# Altium schematic sheet [04] - INPUTS.SchDoc: INPUTS
size A3; Author: Gabriel Piñango; DocumentNumber: 4; Revision: V1I1; SheetNumber: 4; SheetTotal: 6; Collaborator: Gabriel Pinango; Project: MultiTestcard; VersionRevision: V1I1; Designer: Gabriel Pinango
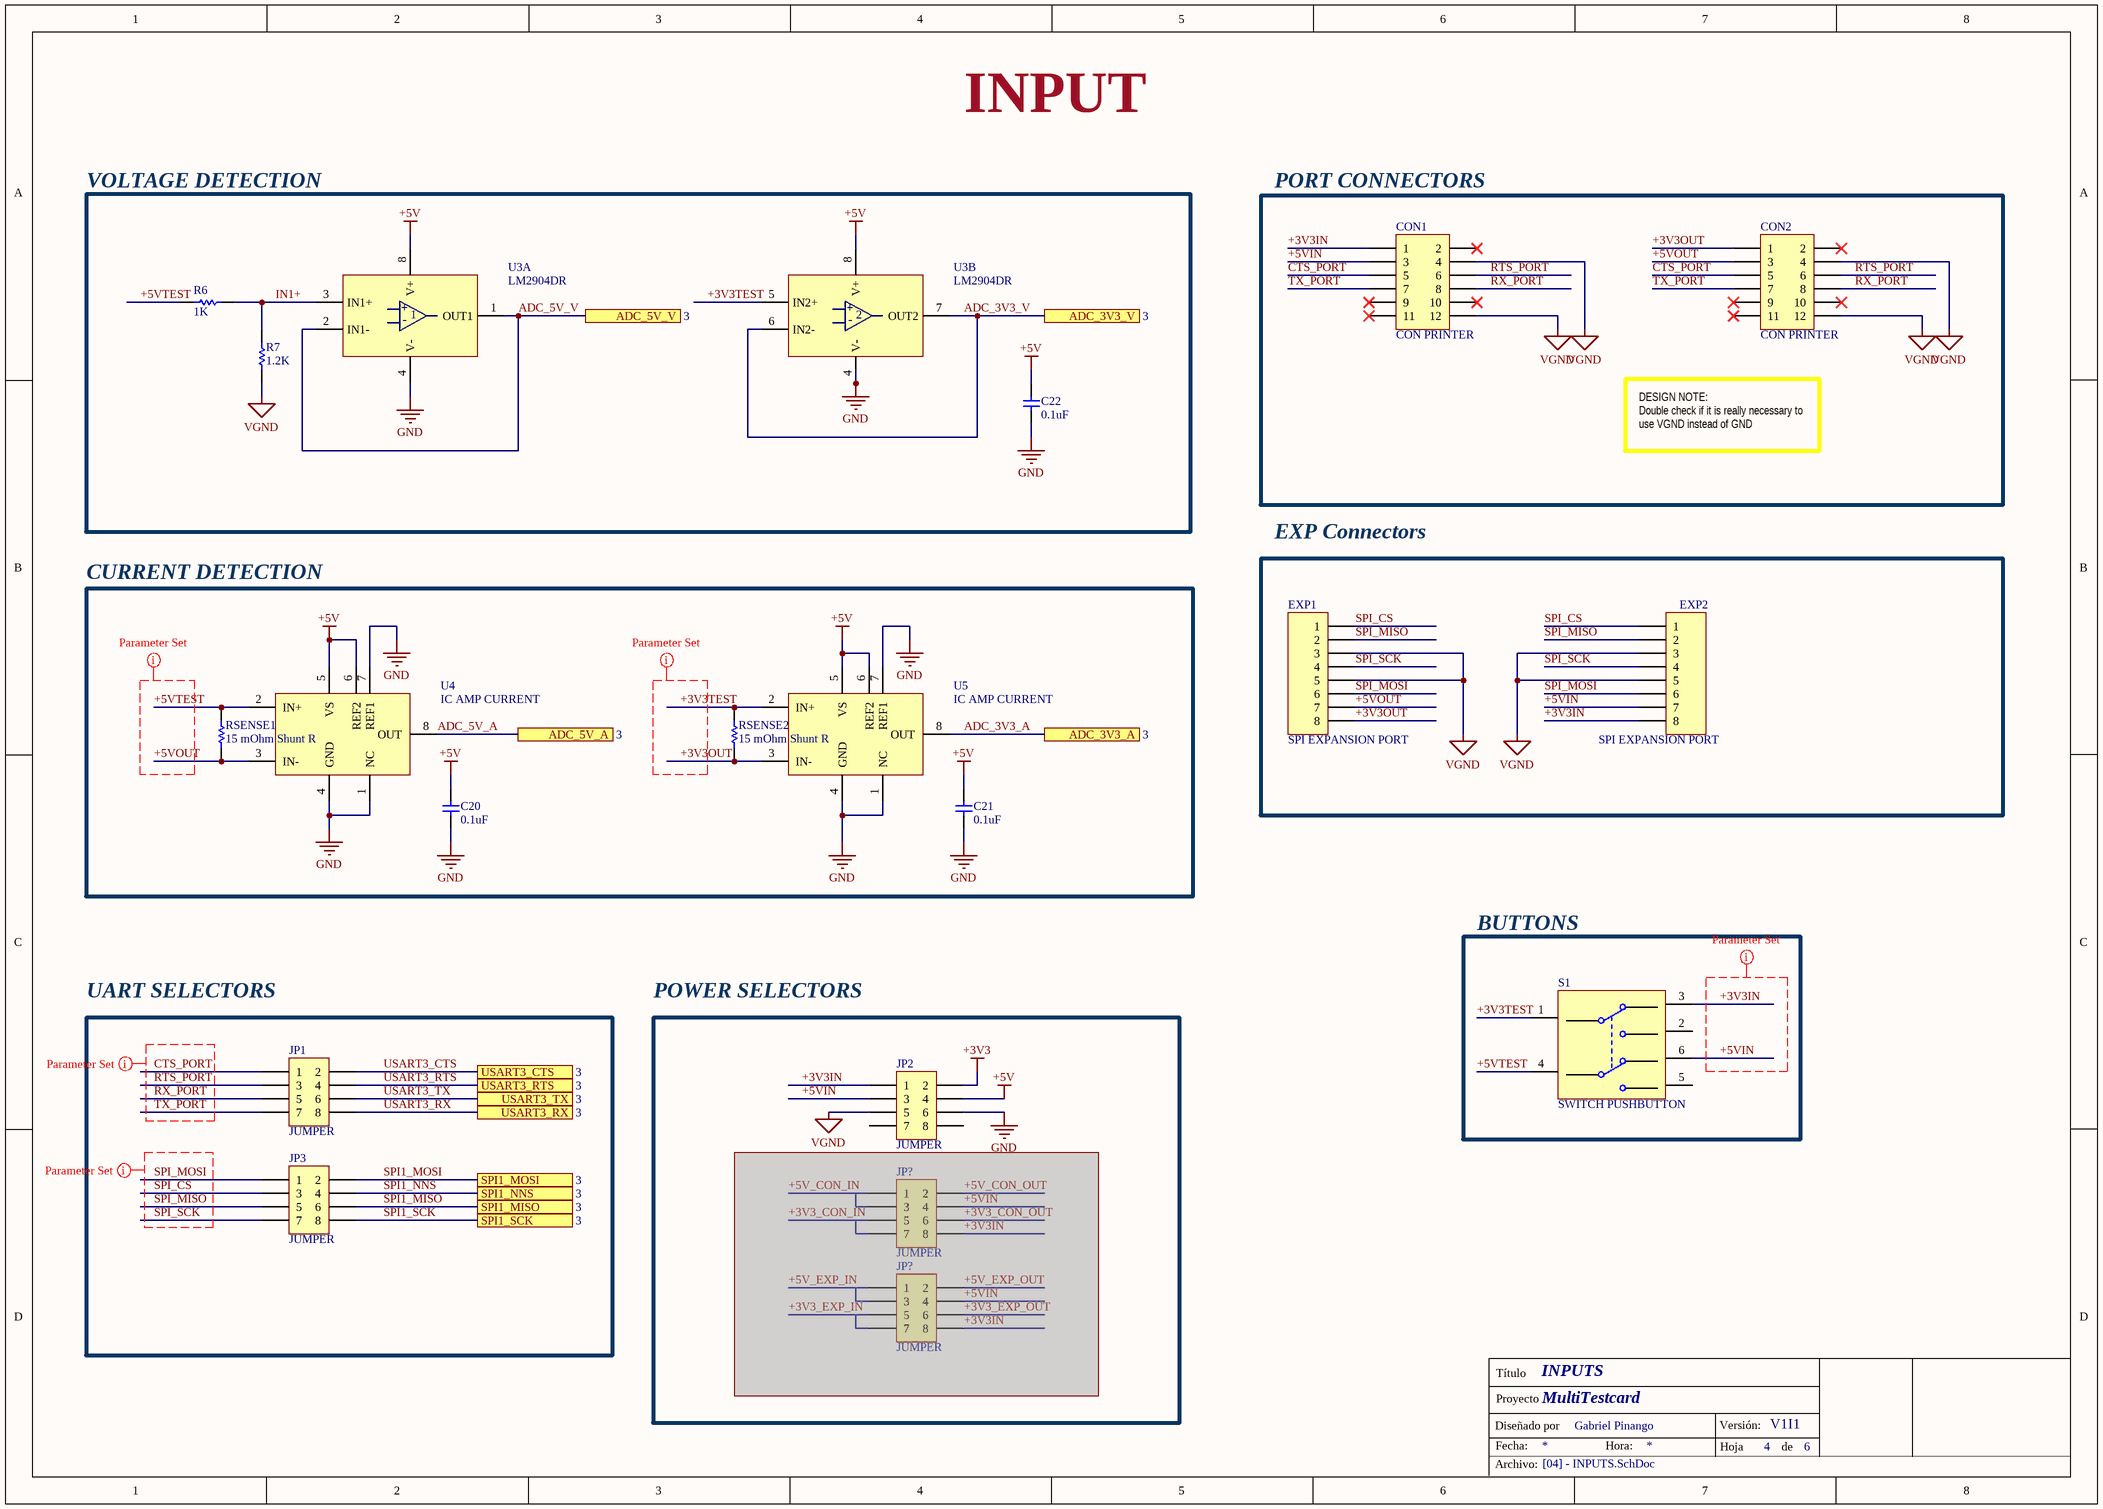
[diagram p0: [04] - INPUTS.SchDoc]

## Parts
(Parts that share a designator on the sheet are numbered #1, #2 ... from top to bottom, then left to right.)
C20  0.1uF  [CC-0603]
C21  0.1uF  [CC-0603]
C22  0.1uF  [CC-0603]
CON1  CON PRINTER  [Header 2x6 B12B PHDS]
CON2  CON PRINTER  [Header 2x6 B12B PHDS]
EXP1  SPI EXPANSION PORT  [CONN FPC/FFC 8POS]
EXP2  SPI EXPANSION PORT  [CONN FPC/FFC 8POS]
JP1  JUMPER  [HDR4X2]
JP2  JUMPER  [HDR4X2]
JP3  JUMPER  [HDR4X2]
JP?#1  JUMPER  [HDR4X2]  (masked out: inside a compile mask, not in the netlist)
JP?#2  JUMPER  [HDR4X2]  (masked out: inside a compile mask, not in the netlist)
R6  1K  [R-0603]
R7  1.2K  [R-0603]
RSENSE1  15 mOhm Shunt R  [R-2512]
RSENSE2  15 mOhm Shunt R  [R-2512]
S1  SWITCH PUSHBUTTON  [UB26SKW03N]
U3  LM2904DR  [8-SOIC]  (parts A,B of 2)
U4  IC AMP CURRENT  [8-TSSOP]
U5  IC AMP CURRENT  [8-TSSOP]

## Blocks framed on the sheet
VOLTAGE DETECTION: C22 R6 R7 U3
PORT CONNECTORS: CON1 CON2
EXP Connectors: EXP1 EXP2
CURRENT DETECTION: C20 C21 RSENSE1 RSENSE2 U4 U5
BUTTONS: S1
UART SELECTORS: JP1 JP3
POWER SELECTORS: JP2 JP?#1 JP?#2

## Ports
ADC_3V3_A (see 3), ADC_3V3_V (see 3), ADC_5V_A (see 3), ADC_5V_V (see 3), SPI1_MISO (see 3), SPI1_MOSI (see 3), SPI1_NNS (see 3), SPI1_SCK (see 3), USART3_CTS (see 3), USART3_RTS (see 3), USART3_RX (see 3), USART3_TX (see 3)

## Nets
+3V3: JP2.2
+5V: C20.1 C21.1 C22.1 JP2.4 U3.8(V+) U4.5(VS) U4.6(REF2) U5.5(VS) U5.6(REF2)
GND: C20.2 C21.2 C22.2 JP2.6 U3.4(V-) U4.1(NC) U4.4(GND) U4.7(REF1) U5.1(NC) U5.4(GND) U5.7(REF1)
VGND: CON1.4 CON1.12 CON2.4 CON2.12 EXP1.3 EXP1.5 EXP2.3 EXP2.5 JP2.5 R7.1
+3V3IN: CON1.1 EXP2.8 JP2.1 S1.3(NC1)
+3V3OUT: CON2.1 EXP1.8 RSENSE2.1 U5.3(IN-)
+3V3TEST: RSENSE2.2 S1.1(COMMON1) U3.5(IN2+) U5.2(IN+)
+5VIN: CON1.3 EXP2.7 JP2.3 S1.6(NC2)
+5VOUT: CON2.3 EXP1.7 RSENSE1.1 U4.3(IN-)
+5VTEST: R6.1 RSENSE1.2 S1.4(COMMON2) U4.2(IN+)
ADC_3V3_A: U5.8(OUT) ; port ADC_3V3_A
ADC_3V3_V: U3.6(IN2-) U3.7(OUT2) ; port ADC_3V3_V
ADC_5V_A: U4.8(OUT) ; port ADC_5V_A
ADC_5V_V: U3.1(OUT1) U3.2(IN1-) ; port ADC_5V_V
CTS_PORT: CON1.5 CON2.5 JP1.1
IN1+: R6.2 R7.2 U3.3(IN1+)
RTS_PORT: CON1.6 CON2.6 JP1.3
RX_PORT: CON1.8 CON2.8 JP1.5
SPI1_MISO: JP3.6 ; port SPI1_MISO
SPI1_MOSI: JP3.2 ; port SPI1_MOSI
SPI1_NNS: JP3.4 ; port SPI1_NNS
SPI1_SCK: JP3.8 ; port SPI1_SCK
SPI_CS: EXP1.1 EXP2.1 JP3.3
SPI_MISO: EXP1.2 EXP2.2 JP3.5
SPI_MOSI: EXP1.6 EXP2.6 JP3.1
SPI_SCK: EXP1.4 EXP2.4 JP3.7
TX_PORT: CON1.7 CON2.7 JP1.7
USART3_CTS: JP1.2 ; port USART3_CTS
USART3_RTS: JP1.4 ; port USART3_RTS
USART3_RX: JP1.8 ; port USART3_RX
USART3_TX: JP1.6 ; port USART3_TX

Not connected (* = marked no-connect by the designer): CON1 2* 9* 10* 11*; CON2 2* 9* 10* 11*; JP2 7 8; S1 2(NO1) 5(NO2)

## Layout directives
net class PWR_TEST: +3V3IN, +3V3OUT, +3V3TEST, +5VIN, +5VOUT, +5VTEST
net class SPI_TEST: SPI_CS, SPI_MISO, SPI_MOSI, SPI_SCK
net class UART_TEST: CTS_PORT, RTS_PORT, RX_PORT, TX_PORT

## Notes on the sheet
- INPUT
- DESIGN NOTE:
  Double check if it is really necessary to use VGND instead of GND
- Título
- Diseñado por
- Fecha:
- Proyecto
- Hora:
- Versión:
- Hoja
- de
- Archivo:
- (in symbol LM2904DR, part A) +; -
- (in symbol LM2904DR, part B) +; -

## Library data of the parts
C20-C22 = CGA3E2X7R1H104K080AA: CAP CER 0.1uF 50V X7R 0603; Manufacturer: TDK; Capacitance: 100nF; Tolerance: 10%; Supplier 1: Digi-Key; Manufacturer Part Number: CGA3E2X7R1H104K080AA; Stock 1: 11580568; Pricing 1: 1=0.1, 10=0.075, 100=0.0335, 500=0.0239, 1000=0.0188 (USD); Mount: Surface Mount; Case/Package: 0603; Weight: 7.1E-05oz; Case Code (Imperial): 0603; Case Code (Metric): 1608; Min Operating Temperature: -55°C; Max Operating Temperature: 125°C; Packaging: Tape and Reel; Package Quantity: 1; Voltage Rating: 50V; Dielectric: X7R; Voltage Rating (DC): 50V; Termination: SMD/SMT; Voltage: 50V; Composition: Ceramic; Length: 1.6mm; Height: 0.8mm; Width: 0.8mm; Thickness: 0.035inch; Depth: 0.8mm; Ratings: AEC-Q200; Radiation Hardening: No; REACH SVHC: No SVHC; Lead Free: Lead Free; ComponentLink1URL: http://www.farnell.com/datasheets/1796654.pdf?src-supplier=Mouser; ComponentLink1Description: http://www.farnell.com/datasheets/1796654.pdf?src-supplier=Mouser; ComponentLink2URL: http://product.tdk.com/capacitor/mlcc/en/documents/mlccspec_automotive_general_midvoltage_en.pdf?src-supplier=Future+Electronics; ComponentLink2Description: http://product.tdk.com/capacitor/mlcc/en/documents/mlccspec_automotive_general_midvoltage_en.pdf?src-supplier=Future+Electronics; ComponentLink3URL: http://www.farnell.com/datasheets/1735392.pdf?src-supplier=Element14; ComponentLink3Description: http://www.farnell.com/datasheets/1735392.pdf?src-supplier=Element14; ComponentLink4URL: https://www.verical.com/server-webapp/html/getDatasheet?partID=715867&src-supplier=Verical; ComponentLink4Description: https://www.verical.com/server-webapp/html/getDatasheet?partID=715867&src-supplier=Verical; ComponentLink5URL: http://www.farnell.com/datasheets/1796654.pdf?src-supplier=Newark; ComponentLink5Description: http://www.farnell.com/datasheets/1796654.pdf?src-supplier=Newark; Supplier Part Number 1: 445-5666-6-ND
CON1 CON2 = DF11-12DP-2DSA(24): CONN HEADER VERT 12POS 2MM; Manufacturer: Hirose; Number of Positions: 12; Gender: Male; Connector Type: Male Pin; Current Rating: 2A; Voltage Rating: 250V; Insulation Resistance: 1GR; Row Spacing: 0.079inch; Supplier 1: Digi-Key; Manufacturer Part Number: DF11-12DP-2DSA(24); Stock 1: 1827; Pricing 1: 1=0.61, 10=0.57, 100=0.437, 500=0.38, 1000=0.3135 (USD); Mount: Through Hole; Color: Black; Housing Color: Black; Housing Material: Polyamide; Contact Plating: Tin,Gold; Contact Material: Brass,Copper Alloy,Tin; Number of Rows: 2; Package Quantity: 34; Packaging: Rail/Tube; Termination: Solder; Number of Contacts: 12; Contact Gender: Male; Orientation: Straight; Fastening Type: Detent; Pitch: 2mm; Contact Mating Length: 0.118inch; Radiation Hardening: No; Lead Free: Lead Free; REACH SVHC: No SVHC; Flammability Rating: UL94 V-0; ComponentLink1URL: http://uk.rs-online.com/webdocs/14ef/0900766b814efacf.pdf?src-supplier=RSComponents; ComponentLink1Description: http://uk.rs-online.com/webdocs/14ef/0900766b814efacf.pdf?src-supplier=RSComponents; ComponentLink2URL: https://www.distrelec.biz/Web/Downloads/_t/ds/DF11serie_eng_tds.pdf?mime=application%2Fpdf&src-supplier=Distrelec; ComponentLink2Description: https://www.distrelec.biz/Web/Downloads/_t/ds/DF11serie_eng_tds.pdf?mime=application%2Fpdf&src-supplier=Distrelec; Supplier Part Number 1: H10233-ND
EXP1 EXP2 = HLW8S-2C7LF: CONN FFC FPC VERT 8POS 1MM PCB; Manufacturer: Amphenol FCI; Contact Resistance: 30mR; Current Rating: 1A; Voltage Rating: 100V; Number of Positions: 8; Contact Location: Top; Insulation Resistance: 500MR; Gender: Receptacle; Wire/Cable Type: Straight; Supplier 1: Digi-Key; Manufacturer Part Number: HLW8S-2C7LF; Stock 1: 4257; Pricing 1: 1=0.22, 10=0.204, 25=0.1744, 50=0.1526, 100=0.1417, 250=0.1254, 500=0.1199, 1000=0.0981, 2500=0.0899 (USD); Mount: Through Hole; Contact Material: Bronze; Contact Plating: Tin; Housing Color: Black; Housing Material: Polybutylene; Min Operating Temperature: -55°C; Max Operating Temperature: 85°C; Number of Rows: 1; Package Quantity: 250; Packaging: Tray; Voltage Rating (AC): 100V; Termination: Solder; Max Voltage Rating (AC): 100V; Number of Contacts: 8; Max Voltage Rating (DC): 100V; Orientation: Straight; Length: 10.6mm; Pitch: 1mm; Depth: 3.9mm; Width: 3.9mm; Radiation Hardening: No; REACH SVHC: No SVHC; Lead Free: Lead Free; Flammability Rating: UL94 V-0; ComponentLink1URL: https://cdn.amphenol-icc.com/media/wysiwyg/files/drawing/hlw01lf.pdf?src-supplier=Digi-Key; ComponentLink1Description: https://cdn.amphenol-icc.com/media/wysiwyg/files/drawing/hlw01lf.pdf?src-supplier=Digi-Key; ComponentLink2URL: http://portal.fciconnect.com/Comergent/fci/drawing/hlw01lf.pdf?src-supplier=Avnet; ComponentLink2Description: http://portal.fciconnect.com/Comergent/fci/drawing/hlw01lf.pdf?src-supplier=Avnet; Supplier Part Number 1: 609-1821-ND
JP1-JP3 JP?#1 JP?#2 = 77313-801-08LF: Headers & Wire Housings 8P STR DR TMT HDR .38 AU .425IN LENGTH; Manufacturer: Amphenol FCI; Number of Contacts: 8; Current Rating: 3A; Voltage Rating: 1.5kV; Insulation Resistance: 5GR; Gender: Male; Connector Type: Male Pin; Pitch: 2.54mm; Row Spacing: 0.1inch; Contact Post Length: 2.41mm; Supplier 1: Digi-Key; Manufacturer Part Number: 77313-801-08LF; Stock 1: 0; Mount: Through Hole; Contact Plating: Gold,GXT; Color: Black; Contact Material: Bronze; Housing Color: Black; Housing Material: Thermoplastic; Min Operating Temperature: -65°C; Max Operating Temperature: 125°C; Number of Rows: 2; Termination: Solder; Package Quantity: 500; Packaging: Bulk; Contact Gender: Male; Number of Positions: 8; Max Voltage Rating (AC): 1.5kV; Orientation: Straight; Series: BERGSTIK®, MezzSelect™, Basics+; Contact Type: Male Pin; Length: 10.16mm; Contact Mating Length: 0.23inch; Depth: 4.83mm; Radiation Hardening: No; Lead Free: Lead Free; Flammability Rating: UL94 V-0; ComponentLink1URL: http://portal.fciconnect.com/Comergent//fci/drawing/77313.pdf?src-supplier=Digi-Key; ComponentLink1Description: http://portal.fciconnect.com/Comergent//fci/drawing/77313.pdf?src-supplier=Digi-Key; ComponentLink2URL: http://portal.fciconnect.com/Comergent/fci/drawing/77313.pdf?src-supplier=Avnet; ComponentLink2Description: http://portal.fciconnect.com/Comergent/fci/drawing/77313.pdf?src-supplier=Avnet; Supplier Part Number 1: 77313-801-08LF-ND
R6 = RC0603FR-071KL: RES SMD 1K OHM 1% 1/10W 0603; Manufacturer: Yageo; Resistance: 1kR; Power Rating: 100mW; Temperature Coefficient: 100ppm/°C; Voltage Rating: 50V; Supplier 1: Digi-Key; Manufacturer Part Number: RC0603FR-071KL; Stock 1: 48702346; Pricing 1: 1=0.1, 10=0.024, 100=0.0097, 1000=0.0044, 2500=0.0038 (USD); Case/Package: 0603; Case Code (Imperial): 0603; Case Code (Metric): 1608; Contact Plating: Tin,Matte; Min Operating Temperature: -55°C; Max Operating Temperature: 155°C; Tolerance: 1%; Packaging: Tape and Reel; Military Standard: Not; Termination: SMD/SMT; Composition: Thick Film; Length: 1.6mm; Height: 0.45mm; Depth: 0.8mm; Radiation Hardening: No; REACH SVHC: No SVHC; Lead Free: Lead Free; ComponentLink1URL: http://documents.rs-components.com/techlib://itc_doclist_GB.htm?stockno=5048928&src-supplier=RSComponents; ComponentLink1Description: http://documents.rs-components.com/techlib://itc_doclist_GB.htm?stockno=5048928&src-supplier=RSComponents; ComponentLink2URL: http://www.yageo.com/documents/recent/PYu-RC0603_51_RoHS_L_4.pdf?src-supplier=Avnet+Europe; ComponentLink2Description: http://www.yageo.com/documents/recent/PYu-RC0603_51_RoHS_L_4.pdf?src-supplier=Avnet+Europe; ComponentLink3URL: http://www.farnell.com/datasheets/2167052.pdf?src-supplier=Element14; ComponentLink3Description: http://www.farnell.com/datasheets/2167052.pdf?src-supplier=Element14; ComponentLink4URL: http://www.farnell.com/datasheets/1868787.pdf?src-supplier=Element14; ComponentLink4Description: http://www.farnell.com/datasheets/1868787.pdf?src-supplier=Element14; ComponentLink5URL: http://www.yageo.com/documents/recent/PYu-RC_Group_51_RoHS_L_2.pdf?src-supplier=Avnet; ComponentLink5Description: http://www.yageo.com/documents/recent/PYu-RC_Group_51_RoHS_L_2.pdf?src-supplier=Avnet; ComponentLink6URL: https://www.verical.com/server-webapp/html/getDatasheet?partID=404327&src-supplier=Verical; ComponentLink6Description: https://www.verical.com/server-webapp/html/getDatasheet?partID=404327&src-supplier=Verical; ComponentLink7URL: http://www.farnell.com/datasheets/443971.pdf?src-supplier=Element14; ComponentLink7Description: http://www.farnell.com/datasheets/443971.pdf?src-supplier=Element14; Supplier Part Number 1: 311-1.00KHRDKR-ND
R7 = CRCW06031K20FKEA: RES SMD 1.2K OHM 1% 1/10W 0603; Manufacturer: Vishay; Resistance: 1.2kR; Power Rating: 100mW; Voltage Rating: 75V; Temperature Coefficient: 100ppm/°C; Supplier 1: Digi-Key; Manufacturer Part Number: CRCW06031K20FKEA; Stock 1: 93302; Pricing 1: 1=0.1, 10=0.036, 100=0.0146, 1000=0.0065, 2500=0.0057 (USD); Mount: Surface Mount; Case/Package: 0603; Weight: 7.1E-05oz; Case Code (Metric): 1608; Case Code (Imperial): 0603; Contact Plating: Tin; Min Operating Temperature: -55°C; Max Operating Temperature: 155°C; Tolerance: 1%; Packaging: Tape and Reel; Composition: Thick Film; Military Standard: Not; Termination: SMD/SMT; Voltage Rating (DC): 75V; Package Quantity: 10; Number of Terminations: 2; Max Power Dissipation: 100mW; Features: Automotive AEC-Q200; Length: 1.55mm; Height: 0.45mm; Width: 0.033inch; Depth: 0.85mm; Radiation Hardening: No; REACH SVHC: Unknown; Lead Free: Lead Free; ComponentLink1URL: http://www.vishay.com/docs/20035/dcrcwe3.pdf?src-supplier=Digi-Key; ComponentLink1Description: http://www.vishay.com/docs/20035/dcrcwe3.pdf?src-supplier=Digi-Key; ComponentLink2URL: http://uk.rs-online.com/webdocs/0d98/0900766b80d98afc.pdf?src-supplier=RSComponents; ComponentLink2Description: http://uk.rs-online.com/webdocs/0d98/0900766b80d98afc.pdf?src-supplier=RSComponents; ComponentLink3URL: https://www.alliedelec.com/m/d/0c934d6939ccefa68dbe0b96d821c8cf.pdf?src-supplier=Allied+Electronics; ComponentLink3Description: https://www.alliedelec.com/m/d/0c934d6939ccefa68dbe0b96d821c8cf.pdf?src-supplier=Allied+Electronics; ComponentLink4URL: http://www.alliedelec.com/m/d/0c934d6939ccefa68dbe0b96d821c8cf.pdf?src-supplier=Allied+Electronics; ComponentLink4Description: http://www.alliedelec.com/m/d/0c934d6939ccefa68dbe0b96d821c8cf.pdf?src-supplier=Allied+Electronics; ComponentLink5URL: https://www.distrelec.biz/Web/Downloads/a_/en/flD-CRCW-e3_data_en.pdf?mime=application%2Fpdf&src-supplier=Distrelec; ComponentLink5Description: https://www.distrelec.biz/Web/Downloads/a_/en/flD-CRCW-e3_data_en.pdf?mime=application%2Fpdf&src-supplier=Distrelec; ComponentLink6URL: http://www.farnell.com/datasheets/2045673.pdf?src-supplier=Element14; ComponentLink6Description: http://www.farnell.com/datasheets/2045673.pdf?src-supplier=Element14; ComponentLink7URL: http://www.mouser.com/ds/2/427/dcrcwe3-109170.pdf?src-supplier=Mouser; ComponentLink7Description: http://www.mouser.com/ds/2/427/dcrcwe3-109170.pdf?src-supplier=Mouser; ComponentLink8URL: http://www.farnell.com/datasheets/2111203.pdf?src-supplier=Element14; ComponentLink8Description: http://www.farnell.com/datasheets/2111203.pdf?src-supplier=Element14; Supplier Part Number 1: 541-1.20KHCT-ND
RSENSE1 RSENSE2 = CRA2512-FZ-R015ELF: Res 2512 0.015 Ohm 1% 3W 75ppm/C Molded SMD SMD T/R; Manufacturer: Bourns; Resistance: 15mR; Temperature Coefficient: 75ppm/°C; Supplier 1: Digi-Key; Manufacturer Part Number: CRA2512-FZ-R015ELF; Stock 1: 25516; Pricing 1: 1=0.69, 10=0.578, 25=0.4956, 50=0.446, 100=0.3881, 250=0.3468, 500=0.2808, 1000=0.2271 (USD); Mount: Surface Mount; Case/Package: 2512; Case Code (Metric): 6432; Case Code (Imperial): 2512; Min Operating Temperature: -55°C; Max Operating Temperature: 170°C; Power Rating: 3W; Tolerance: 1%; Packaging: Tape and Reel; Package Quantity: 1; Composition: Metal Film,Thick Film; Number of Terminations: 2; Military Standard: Not; Termination: Solder; Max Power Dissipation: 3W; Features: Moisture Resistant; Length: 0.254inch; Height: 0.035inch; Width: 0.126inch; Depth: 3.2mm; REACH SVHC: No SVHC; Lead Free: Lead Free; ComponentLink1URL: http://www.bourns.com/docs/Product-Datasheets/CRA.pdf?src-supplier=Digi-Key; ComponentLink1Description: http://www.bourns.com/docs/Product-Datasheets/CRA.pdf?src-supplier=Digi-Key; ComponentLink2URL: https://www.bourns.com/docs/Product-Datasheets/CRA.pdf?src-supplier=Digi-Key; ComponentLink2Description: https://www.bourns.com/docs/Product-Datasheets/CRA.pdf?src-supplier=Digi-Key; ComponentLink3URL: http://uk.rs-online.com/webdocs/0ddc/0900766b80ddce06.pdf?src-supplier=RSComponents; ComponentLink3Description: http://uk.rs-online.com/webdocs/0ddc/0900766b80ddce06.pdf?src-supplier=RSComponents; ComponentLink4URL: http://www.produktinfo.conrad.com/datenblaetter/1000000-1099999/001055548-da-01-en-WID_CRA2512_FZ_R015ELF__0_015_OHM_3W_1_.pdf?src-supplier=Conrad; ComponentLink4Description: http://www.produktinfo.conrad.com/datenblaetter/1000000-1099999/001055548-da-01-en-WID_CRA2512_FZ_R015ELF__0_015_OHM_3W_1_.pdf?src-supplier=Conrad; Supplier Part Number 1: CRA2512-FZ-R015ELFDKR-ND
S1 = UB25SKW03N-G: SWITCH PUSHBUTTON DPDT 5A 125V; Manufacturer: NKK Switches; Mechanical Life: 1000000Cycles; Voltage Rating (DC): 30V; Electrical Life: 10000Cycles; Switch Function: On-Mom; Actuator Type: Square, Button; Supplier 1: Digi-Key; Manufacturer Part Number: UB25SKW03N-G; Stock 1: 41; Pricing 1: 1=7.79, 10=7.22, 25=7.03, 50=6.84, 100=6.46, 250=6.27, 500=5.89, 1000=5.32 (USD); Mount: Through Hole; Contact Plating: Silver; Min Operating Temperature: -20°C; Max Operating Temperature: 70°C; Packaging: Bulk; Current Rating: 5A; Package Quantity: 1; Voltage Rating (AC): 125V; Termination: PC Pin; Throw Configuration: DPDT; Orientation: Vertical; Lead Free: Lead Free; Flammability Rating: UL94 V-0; ComponentLink1URL: http://www.nkkswitches.com/pdf/ubnonilluminated.pdf?src-supplier=Digi-Key; ComponentLink1Description: http://www.nkkswitches.com/pdf/ubnonilluminated.pdf?src-supplier=Digi-Key; ComponentLink2URL: http://www.nkkswitches.com/pdf/ubilluminated.pdf?src-supplier=Future+Electronics; ComponentLink2Description: http://www.nkkswitches.com/pdf/ubilluminated.pdf?src-supplier=Future+Electronics; Supplier Part Number 1: 360-3471-ND
U3 = LM2904DR: Operational Amplifier, Dual, 700 kHz, 2, 0.3 V/ s, 1.5V to 13V, SOIC, 8 ;RoHS Compliant: Yes; Manufacturer: Texas Instruments; Unity Gain Bandwidth Product: 700kHz; Slew Rate: 0.3V/µs; Common Mode Rejection Ratio: 50dB; Max Supply Voltage: 26V; Min Supply Voltage: 3V; Voltage Gain: 100dB; Number of Channels: 2; Output Current: 30mA; Nominal Supply Current: 1.2mA; Dual Supply Voltage: 9V; Input Bias Current: 250nA; Input Offset Voltage (Vos): 7mV; Operating Supply Current: 1mA; Supplier 1: Digi-Key; Manufacturer Part Number: LM2904DR; Stock 1: 117399; Pricing 1: 1=0.41, 10=0.305, 25=0.2752, 100=0.15, 250=0.145, 500=0.13, 1000=0.1 (USD); Mount: Surface Mount; Case/Package: SOIC; Number of Pins: 8; Min Operating Temperature: -40°C; Max Operating Temperature: 125°C; Min Dual Supply Voltage: 1.5V; Max Dual Supply Voltage: 13V; Packaging: Tape and Reel; Bandwidth: 700kHz; Package Quantity: 1; Operating Supply Voltage: 13V; Number of Circuits: 2; Gain Bandwidth Product: 700kHz; Output Current per Channel: 30mA; Number of Elements: 2; Number of Amplifiers: 2; Length: 4.9mm; Height: 1.58mm; Width: 3.91mm; Radiation Hardening: No; REACH SVHC: No SVHC; Lead Free: Lead Free; ComponentLink1URL: http://www.jameco.com/Jameco/Products/ProdDS/902371.pdf?src-supplier=Jameco; ComponentLink1Description: http://www.jameco.com/Jameco/Products/ProdDS/902371.pdf?src-supplier=Jameco; ComponentLink2URL: http://www.farnell.com/datasheets/2020388.pdf?src-supplier=Element14; ComponentLink2Description: http://www.farnell.com/datasheets/2020388.pdf?src-supplier=Element14; ComponentLink3URL: http://www.farnell.com/datasheets/1840278.pdf?src-supplier=Element14; ComponentLink3Description: http://www.farnell.com/datasheets/1840278.pdf?src-supplier=Element14; ComponentLink4URL: http://www.ti.com/lit/ds/symlink/lm258a.pdf?src-supplier=Digi-Key; ComponentLink4Description: http://www.ti.com/lit/ds/symlink/lm258a.pdf?src-supplier=Digi-Key; ComponentLink5URL: http://www.ti.com/general/docs/lit/getliterature.tsp?genericPartNumber=LM158A&&fileType=pdf&src-supplier=Avnet; ComponentLink5Description: http://www.ti.com/general/docs/lit/getliterature.tsp?genericPartNumber=LM158A&&fileType=pdf&src-supplier=Avnet; Supplier Part Number 1: 296-14596-1-ND
U4 U5 = INA240A1PWR: IC AMP CURRENT SENSE 8-TSSOP; Manufacturer: Texas Instruments; Number of Circuits: 1; Slew Rate: 2V/µs; -3db Bandwidth: 400kHz; Input Bias Current: 90uA; Input Offset Voltage (Vos): 5uV; Operating Supply Current: 1.8mA; Supplier 1: Digi-Key; Manufacturer Part Number: INA240A1PWR; Stock 1: 19787; Pricing 1: 1=2.65, 10=2.377, 100=1.9109, 500=1.57, 1000=1.3008 (USD); Mount: Surface Mount; Case/Package: TSSOP; Min Operating Temperature: -40°C; Max Operating Temperature: 125°C; Packaging: Tape and Reel; Lead Free: Lead Free; Supplier Part Number 1: 296-45088-6-ND